# EAGLE design Mini_Ultra_Base_Shield (EAGLE 9.1.3)
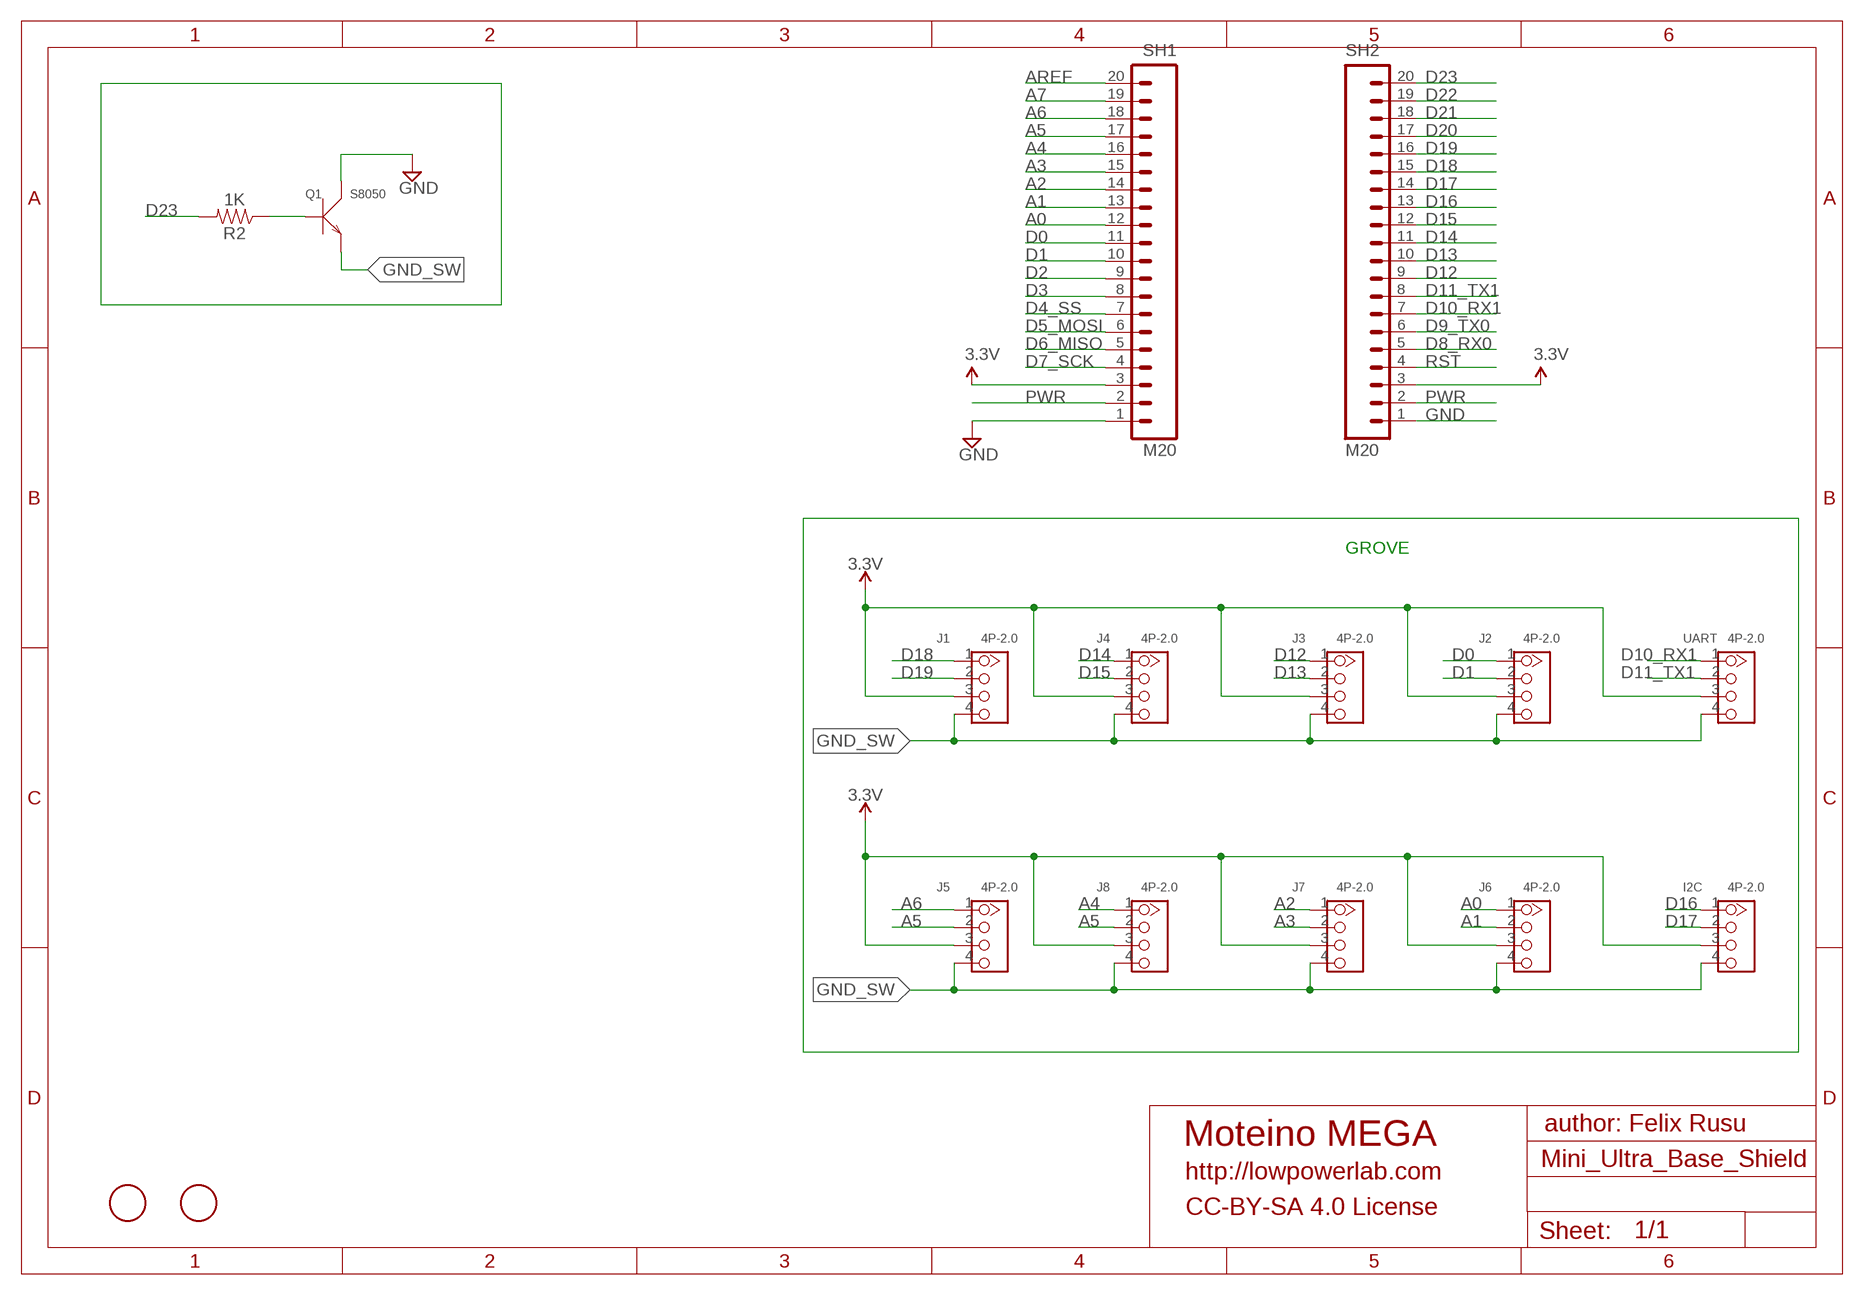
[diagram p0: schematic, sheet 1]

## Parts
I2C  4P-2.0  GROVE-CONNECTOR-DIP(4P-2.0)  [HW4-2.0]
J1  4P-2.0  GROVE-CONNECTOR-DIP(4P-2.0)  [HW4-2.0]
J2  4P-2.0  GROVE-CONNECTOR-DIP(4P-2.0)  [HW4-2.0]
J3  4P-2.0  GROVE-CONNECTOR-DIP(4P-2.0)  [HW4-2.0]
J4  4P-2.0  GROVE-CONNECTOR-DIP(4P-2.0)  [HW4-2.0]
J5  4P-2.0  GROVE-CONNECTOR-DIP(4P-2.0)  [HW4-2.0]
J6  4P-2.0  GROVE-CONNECTOR-DIP(4P-2.0)  [HW4-2.0]
J7  4P-2.0  GROVE-CONNECTOR-DIP(4P-2.0)  [HW4-2.0]
J8  4P-2.0  GROVE-CONNECTOR-DIP(4P-2.0)  [HW4-2.0]
Q1  S8050  SMD-TRANSISTORS-NPN-25V-500MW-S8050(SOT-23)  [SOT-23]
R2  1K  2.0KOHM-0603-1/10W-5%  [0603]
SH1  M20  [1X20]
SH2  M20  [1X20]
U$2  FIDUCIAL  [FIDUCIAL_1MM]
U$7  FIDUCIAL  [FIDUCIAL_1MM]
UART  4P-2.0  GROVE-CONNECTOR-DIP(4P-2.0)  [HW4-2.0]

## Nets
A0: J6.1 SH1.12
A1: J6.2 SH1.13
A2: J7.1 SH1.14
A3: J7.2 SH1.15
A4: J8.1 SH1.16
A5: J5.2 J8.2 SH1.17
A6: J5.1 SH1.18
A7: SH1.19
AREF: SH1.20
D0: J2.1 SH1.11
D1: J2.2 SH1.10
D2: SH1.9
D3: SH1.8
D4_SS: SH1.7
D5_MOSI: SH1.6
D6_MISO: SH1.5
D7_SCK: SH1.4
D8_RX0: SH2.5
D9_TX0: SH2.6
D10_RX1: SH2.7 UART.1
D11_TX1: SH2.8 UART.2
D12: J3.1 SH2.9
D13: J3.2 SH2.10
D14: J4.1 SH2.11
D15: J4.2 SH2.12
D16: I2C.1 SH2.13
D17: I2C.2 SH2.14
D18: J1.1 SH2.15
D19: J1.2 SH2.16
D20: SH2.17
D21: SH2.18
D22: SH2.19
D23: R2.2 SH2.20
GND [power]: Q1.3(C) SH1.1 SH2.1
GND_SW: I2C.4 J1.4 J2.4 J3.4 J4.4 J5.4 J6.4 J7.4 J8.4 Q1.2(E) UART.4
N$6: Q1.1(B) R2.1
PWR [power]: SH1.2 SH2.2
RST: SH2.4
VCC [power]: I2C.3 J1.3 J2.3 J3.3 J4.3 J5.3 J6.3 J7.3 J8.3 SH1.3 SH2.3 UART.3 ; supply symbol labelled 3.3V

## Notes on the sheet
- GROVE
- author: Felix Rusu
- Moteino MEGA
- http://lowpowerlab.com
- CC-BY-SA 4.0 License

## Library data of the parts
I2C J1-J8 UART = Seeed-Connector:GROVE-CONNECTOR-DIP(4P-2.0): 320110033
Q1 = Seeed-Transistor:SMD-TRANSISTORS-NPN-25V-500MW-S8050(SOT-23): 305010017; MPN: S8050
R2 = SparkFun-Resistors:2.0KOHM: 2kΩ resistor A resistor is a passive two-terminal electrical component that implements electrical resistance as a circuit element. Resistors act to reduce current flow, and, at the same time, act to lower voltage levels within circuits. - Wikipedia; PROD_ID: RES-08296; VALUE: 2.0k
SH1 SH2 = SparkFun-Connectors:M20: 1x20 .1" header This is just like the LOCK variant in that the holes are staggared by 5 mil, but except for the last two holes. They are not altered from the "standard" footprint layout. This is used for a special purpose on the layout of our Graphic LCD Backpack. Make sure you want to use this device before selecting it for you project!
U$2 U$7 = adafruit:FIDUCIAL: For use by pick and place machines to calibrate the vision/machine, 1mm By microbuilder.eu

## Net classes
1 power: width 0.381 mm, clearance 0.254 mm
3 usbvcc: width 0.203 mm, drill 0.305 mm, clearance 0.203 mm

## Board
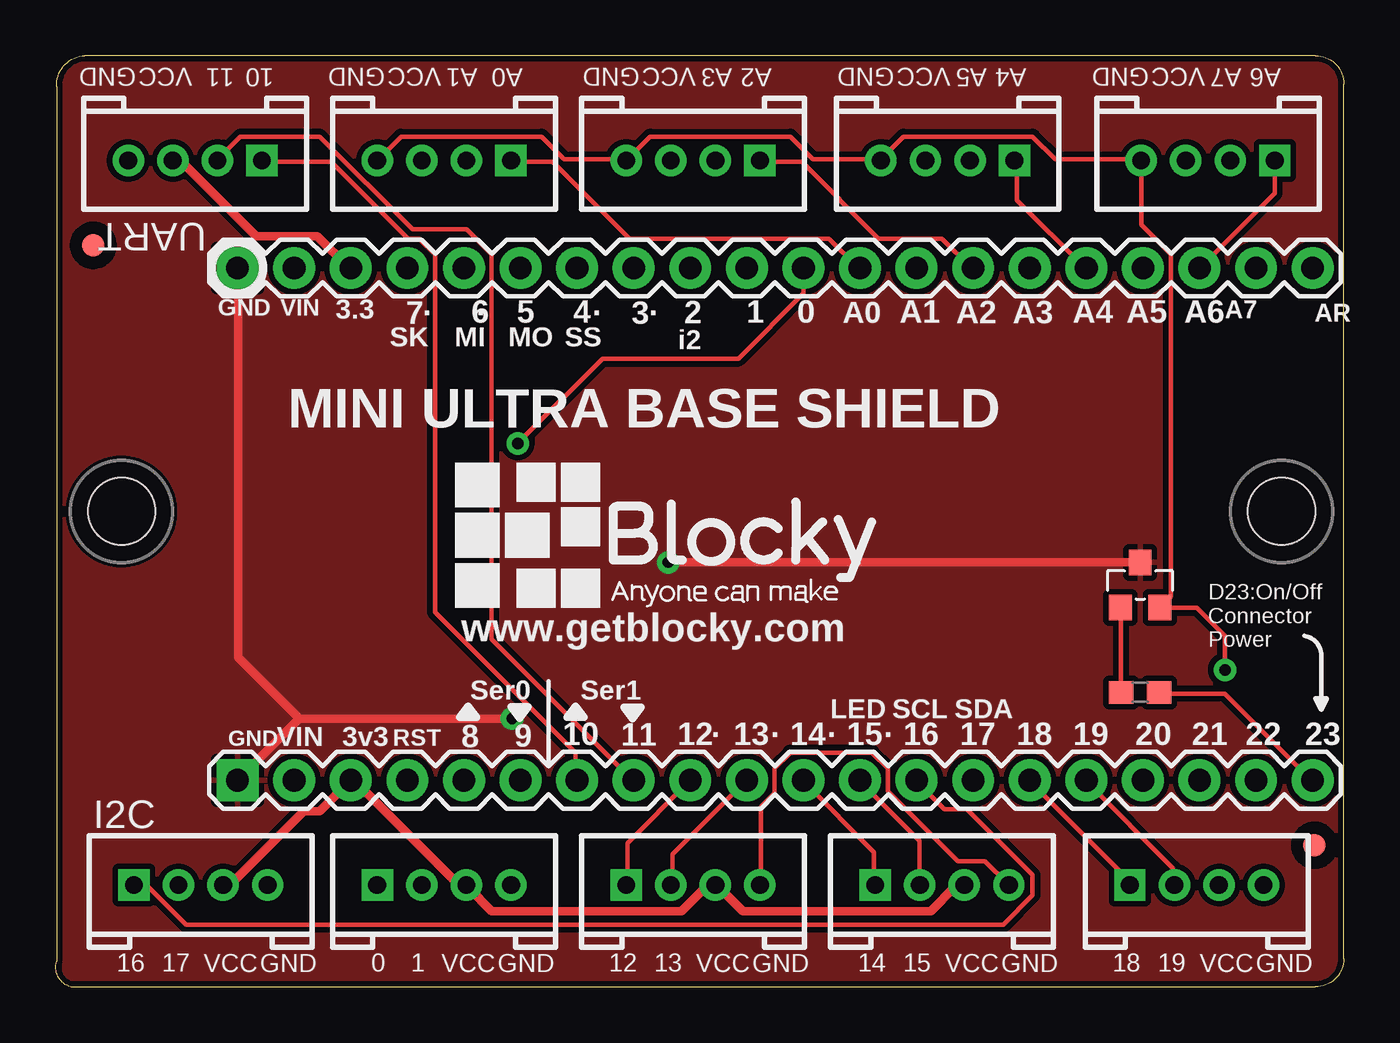
[diagram p1: board, top side]
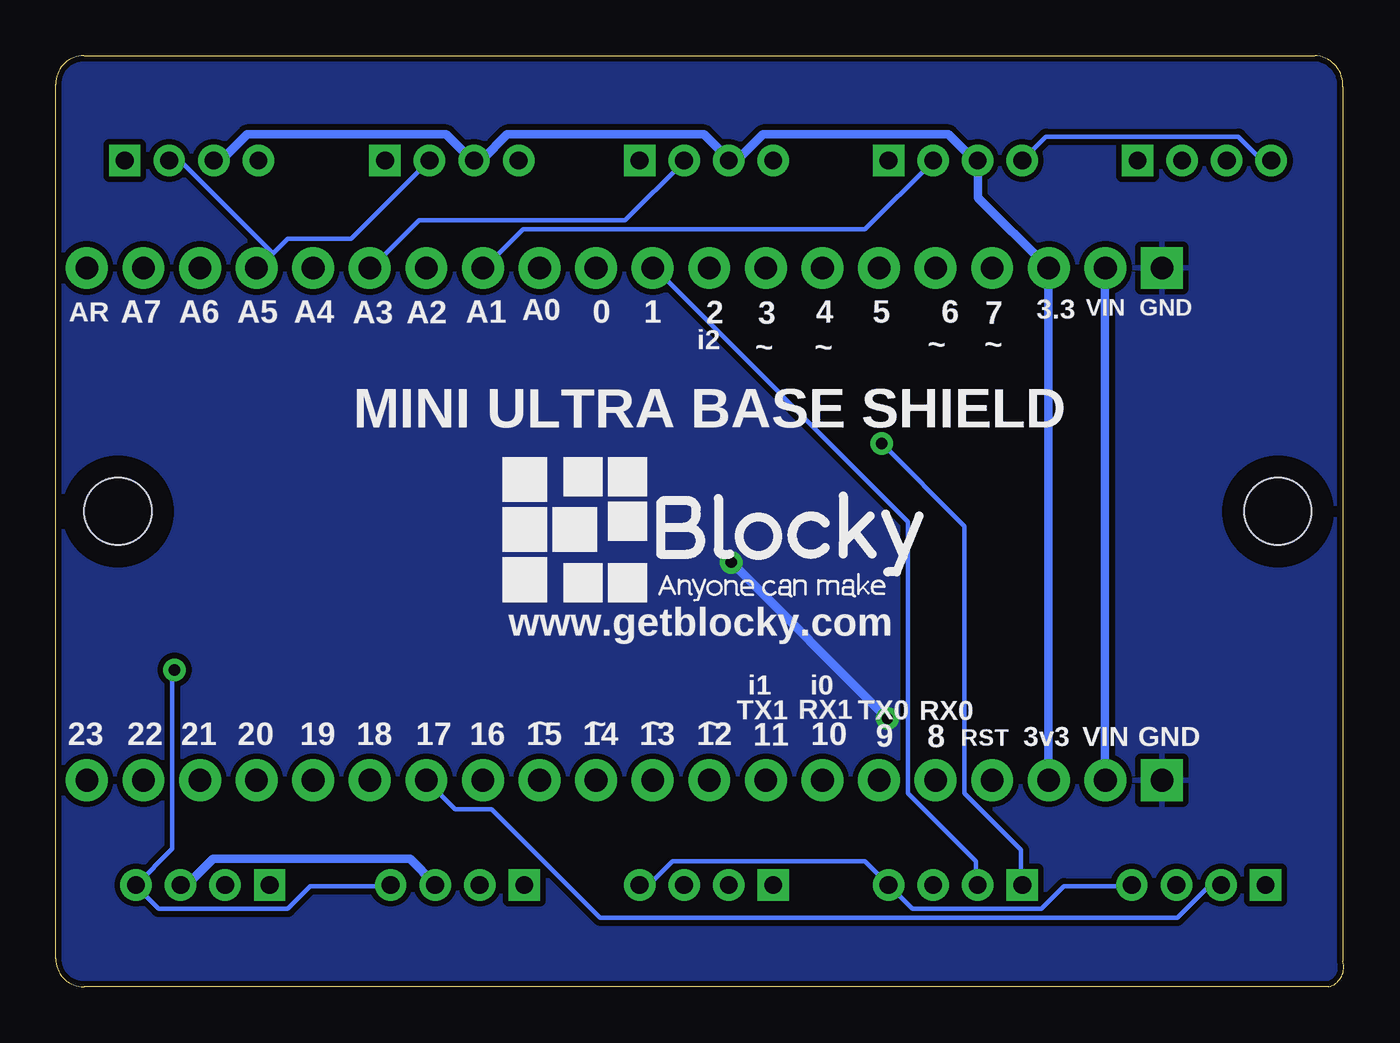
[diagram p2: board, bottom side, seen from below]

Size 57.82 x 41.78 mm. Coordinates in mm from the lower left corner, seen from the top.
Outline: 0.67,0 56.55,0 arc90 57.82,1.27 57.82,40.51 arc90 56.55,41.78 1.31,41.78 arc90 0.04,40.39 0.04,1.14 arc90 0.67,0
Copper layers (1*16): Top 0.035mm / dielectric 1.5mm / Bottom 0.035mm
Design rules "SparkFun": minimum track width 8mil, minimum drill 20mil, track to track 8mil, track to pad 8mil, pad to pad 8mil, via to via 8mil, smd to smd 8mil, copper to edge 10mil, drill to drill 8mil, minimum pad ring 12mil, minimum via ring 10mil, stop-mask expansion 4mil, vias tented up to drill 25mil, thermal gap 10mil

### Footprints (pad centres in the part's own frame; a part is rotated, then mirrored left to right if it is on the bottom)
HW4-2.0 = drill 0.8 pad 1.27 square: 1 -3,0 | drill 0.8 pad 1.27: 2 -1,0; 3 1,0; 4 3,0
SOT-23 = smd 1.016 x 1.143: 1 -0.889,-1.016; 2 0.889,-1.016; 3 0,1.016
0603 = smd 1.1 x 1: 1 -0.85,0; 2 0.85,0
1X20 = drill 1.016 pad 1.88 square: 1 0,0 | drill 1.016 pad 1.88: 2 2.54,0; 3 5.08,0; 4 7.62,0; 5 10.16,0; 6 12.7,0; 7 15.24,0; 8 17.78,0; 9 20.32,0; 10 22.86,0; 11 25.4,0; 12 27.94,0; 13 30.48,0; 14 33.02,0; 15 35.56,0; 16 38.1,0; 17 40.64,0; 18 43.18,0; 19 45.72,0; 20 48.26,0
KFH-M3 = hole 3: 0,0
FIDUCIAL_1MM = smd 1 x 1: 1 0,0

### Placement (x,y rotation side)
I2C  6.51,4.57 0 top
J1  51.22,4.57 0 top
J2  17.43,4.57 0 top
J3  28.61,4.57 0 top
J4  39.79,4.57 0 top
J5  51.72,37.08 180 top
J6  17.43,37.08 180 top
J7  28.61,37.08 180 top
J8  40.04,37.08 180 top
Q1  48.68,18.03 0 top
R2  48.68,13.21 0 top
SH1  8.16,32.26 0 top
SH2  8.16,9.27 0 top
U$1  [KFH-M3]  55.03,21.34 0 top
U$2  56.51,6.35 0 top
U$3  [BLOCKY_LOGO]  38.77,17.02 0 bottom
U$4  [KFH-M3]  2.96,21.34 0 top
U$5  [BLOCKY_LOGO]  16.93,16.76 0 top
U$7  1.69,33.27 0 top
UART  6.26,37.08 180 top

### Tracks (layer width: path | path; a pad name or v marks a point on that pad's centre or on a via)
A0
  Top 0.203: J6.1 20.48,37.03 22.31,37.03 25.77,33.58 34.71,33.58 36.03,32.26 SH1.12
A1
  Bottom 0.203: J6.2 18.45,37.03 21.5,33.98 36.84,33.98 38.57,32.26 SH1.13
A2
  Top 0.203: J7.1 31.66,37.03 33.49,37.03 36.94,33.58 39.79,33.58 41.11,32.26 SH1.14
A3
  Bottom 0.203: J7.2 29.63,37.03 32.27,34.39 41.51,34.39 43.65,32.26 SH1.15
A4
  Top 0.203: J8.1 43.14,37.03 43.14,35.31 46.19,32.26 SH1.16
A5
  Bottom 0.203: 48.07,32.92 48.73,32.26 SH1.17 | 48.07,32.92 47.41,33.58 44.56,33.58 41.11,37.03 J8.2 | J5.2 52.69,37.03 52.18,37.03 48.12,32.97 48.07,32.92
A6
  Top 0.203: J5.1 54.72,37.03 54.72,35.61 51.37,32.26 SH1.18
D0  (via drill 0.51)
  Top 0.203: v20.74,24.38 24.55,28.19 30.64,28.19 33.56,31.11 SH1.11
  Bottom 0.203: J2.1 14.49,4.62 14.49,6.15 17.03,8.69 17.03,20.68 v20.74,24.38
D1
  Bottom 0.203: J2.2 16.52,4.62 16.52,5.64 19.57,8.69 19.57,20.88 30.95,32.26 SH1.10
D10_RX1
  Top 0.203: UART.1 9.31,37.03 12.35,37.03 15.81,33.58 16.32,33.58 17.03,32.87 17.03,16.82 23.33,10.52 23.33,9.3 SH2.7
D11_TX1
  Top 0.203: UART.2 7.27,37.13 8.29,38.15 11.85,38.15 16.01,33.98 18.45,33.98 19.57,32.87 19.57,15.6 25.87,9.3 SH2.8
D12
  Top 0.203: J3.1 25.66,4.62 25.66,6.45 28.41,9.2 SH2.9
D13
  Top 0.203: J3.2 27.7,4.62 27.7,5.94 30.95,9.2 SH2.10
D14
  Top 0.203: J4.1 36.74,4.62 36.74,6.04 33.59,9.2 SH2.11
D15
  Top 0.203: J4.2 38.77,4.62 38.77,6.55 36.13,9.2 SH2.12
D16
  Top 0.203: I2C.1 3.52,4.52 4.12,4.52 5.85,2.79 42.53,2.79 43.85,4.12 43.85,5.03 40.9,7.98 39.89,7.98 38.67,9.2 SH2.13
D17
  Bottom 0.203: I2C.2 5.55,4.52 6.06,4.52 7.48,3.1 33.39,3.1 38.26,7.98 39.89,7.98 41.11,9.2 SH2.14
D18
  Top 0.203: J1.1 48.12,4.62 48.12,4.83 43.75,9.2 SH2.15
D19
  Top 0.203: J1.2 50.15,4.62 50.15,5.33 46.29,9.2 SH2.16
D23
  Top 0.203: R2.2 49.54,13.16 52.49,13.16 56.35,9.3 SH2.20
GND  (via drill 0.51)
  Top 0.381: v27.49,19.05 48.63,19.05 Q1.3 | 10.93,12.04 v20.48,12.04 | 10.93,12.04 8.19,9.3 SH2.1 | SH1.1 8.19,32.26 8.19,14.78 10.83,12.14 10.93,12.04
  Bottom 0.381: v20.48,12.04 v27.49,19.05
  pour Top: 0.16,41.66 57.82,41.66 57.82,0 0.16,0
  pour Bottom: 0.16,41.66 57.82,41.66 57.82,0 0.16,0
GND_SW  (via drill 0.51)
  Top 0.203: J6.4 14.49,37.13 15.5,38.15 21.8,38.15 22.82,37.13 25.56,37.13 J7.4 25.66,37.13 26.68,38.15 32.98,38.15 34,37.13 36.94,37.13 J8.4 37.04,37.13 38.06,38.15 43.85,38.15 44.87,37.13 48.63,37.13 J5.4 48.73,37.03 48.73,34.19 50.05,32.87 50.05,18.8 50.05,17.5 Q1.2 | 49.54,17.02 Q1.2 | J3.4 31.66,4.62 31.66,8.08 32.27,8.69 32.27,9.8 32.98,10.52 36.64,10.52 37.35,9.8 37.35,8.79 40.5,5.64 41.72,5.64 42.73,4.62 J4.4 | Q1.2 51.22,17.02 52.49,15.75 v52.49,14.22
  Bottom 0.203: UART.4 3.31,37.13 3.72,37.13 4.73,38.15 13.37,38.15 14.39,37.13 J6.4 | I2C.4 9.61,4.52 12.56,4.52 13.57,3.5 19.36,3.5 20.38,4.52 J2.4 20.48,4.62 21.5,5.64 30.13,5.64 31.15,4.62 31.56,4.62 J3.4 | J4.4 42.83,4.52 46.39,4.52 47.41,3.5 53.2,3.5 54.21,4.52 54.22,4.56 | 54.22,4.56 J1.4 | 54.22,4.56 52.59,6.19 52.59,14.12 v52.49,14.22
N$6
  Top 0.203: R2.1 47.81,13.26 47.81,17.02 Q1.1
PWR
  Bottom 0.381: SH2.2 10.73,9.3 10.73,32.26 SH1.2
VCC
  Top 0.381: I2C.3 7.58,4.62 7.88,4.62 11.14,7.87 11.85,7.87 13.17,9.2 SH2.3 13.37,9.3 18.04,4.62 18.35,4.62 J2.3 18.55,4.42 19.57,3.4 28.1,3.4 29.22,4.52 29.52,4.52 J3.3 29.73,4.52 30.85,3.4 39.28,3.4 40.4,4.52 40.7,4.52 J4.3 | UART.3 5.34,37.03 5.65,37.03 9,33.68 11.74,33.68 13.17,32.26 SH1.3
  Bottom 0.381: J1.3 52.18,4.62 51.88,4.62 50.76,5.74 41.92,5.74 40.8,4.62 J4.3 | J5.3 50.66,37.13 50.35,37.13 49.24,38.25 40.29,38.25 39.18,37.13 J8.3 38.97,37.13 38.67,37.13 37.55,38.25 28.71,38.25 27.7,37.24 J7.3 27.59,37.13 27.19,37.13 26.07,38.25 17.74,38.25 16.62,37.13 J6.3 16.42,37.03 16.42,35.41 13.27,32.26 SH1.3 13.27,32.16 13.27,9.3 SH2.3

### Text on the board
tPlace: MINI ULTRA BASE SHIELD
bPlace: MINI ULTRA BASE SHIELD
_tsilk: GND | VCC | 11 | 10 | GND | VCC | A1 | A0 | GND | VCC | A3 | A2 | GND | VCC | A5 | A4 | GND | VCC | A7 | A6 | VIN | 3.3 | 7 | . | . | 6 | 5 | 4 | . | 3 | . | 2 | 1 | 0 | A1 | A2 | A3 | A4 | A5 | A6 | A7 | GND | A0 | AR | SK | MI | MO | SS | i2 | D23:On/Off / Connector / Power | Ser0 | Ser1 | VIN | 3v3 | RST | 8 | 9 | 10 | 11 | 12 | . | 13 | . | 14 | LED | . | 15 | SCL | . | 16 | SDA | 17 | 18 | 19 | 20 | 21 | 22 | 23 | GND | 16 | 17 | VCC | GND | 0 | 1 | VCC | GND | 12 | 13 | VCC | GND | 14 | 15 | VCC | GND | 18 | 19 | VCC | GND
_bsilk: VIN | 3.3 | 7 | 6 | 5 | 4 | 3 | 2 | 1 | 0 | A1 | A2 | A3 | A4 | A5 | A6 | A7 | GND | A0 | AR | ~ | ~ | ~ | ~ | i2 | RX0 | RX1 | i0 | i1 | VIN | 3v3 | RST | 8 | 9 | TX0 | 10 | 11 | TX1 | 12 | ~ | 13 | ~ | 14 | ~ | 15 | ~ | 16 | 17 | 18 | 19 | 20 | 21 | 22 | 23 | GND